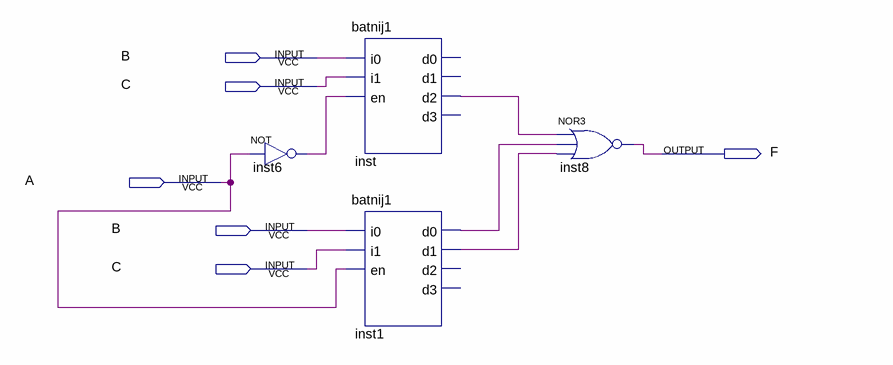
[diagram p0: schematic sheet]
// Quartus schematic da1.bdf as structural Verilog: 4 symbols, 6 pins
module da1 (
  input  B,
  input  C,
  input  A,
  output F
);

  wire inst1_d0, inst1_d1, inst6_out, inst_d2;

  not inst6 (inst6_out, A);
  batnij1 inst (.i0(B), .i1(C), .en(inst6_out), .d2(inst_d2));  // open: d0, d1, d3
  batnij1 inst1 (.i0(B), .i1(C), .en(A), .d0(inst1_d0), .d1(inst1_d1));  // open: d2, d3
  nor inst8 (F, inst_d2, inst1_d0, inst1_d1);
endmodule
